# EAGLE design Teensy_Stromzaehler (EAGLE 9.6.0)
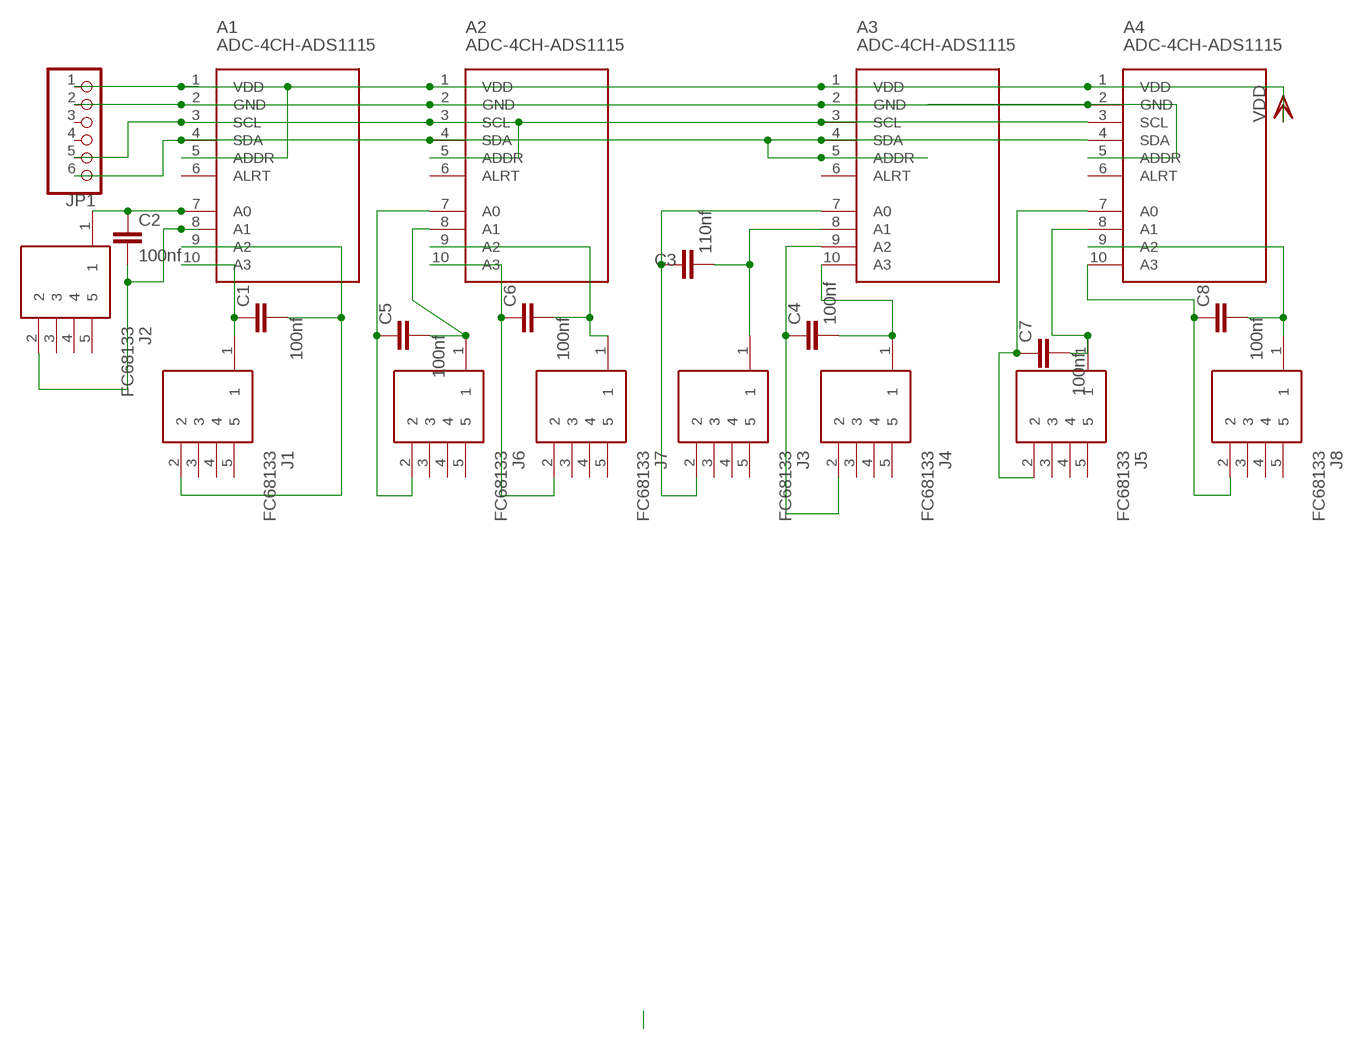
[diagram p0: schematic, sheet 1]

## Parts
A1  ADC-4CH-ADS1115  [ADC-4CH-ADS1115]
A2  ADC-4CH-ADS1115  [ADC-4CH-ADS1115]
A3  ADC-4CH-ADS1115  [ADC-4CH-ADS1115]
A4  ADC-4CH-ADS1115  [ADC-4CH-ADS1115]
C1  100nf  C-EU025-024X044  [C025-024X044]
C2  100nf  C-EU025-024X044  [C025-024X044]
C3  110nf  C-EU025-024X044  [C025-024X044]
C4  100nf  C-EU025-024X044  [C025-024X044]
C5  100nf  C-EU025-024X044  [C025-024X044]
C6  100nf  C-EU025-024X044  [C025-024X044]
C7  100nf  C-EU025-024X044  [C025-024X044]
C8  100nf  C-EU025-024X044  [C025-024X044]
J1  FC68133  [FC68133]
J2  FC68133  [FC68133]
J3  FC68133  [FC68133]
J4  FC68133  [FC68133]
J5  FC68133  [FC68133]
J6  FC68133  [FC68133]
J7  FC68133  [FC68133]
J8  FC68133  [FC68133]
JP1  PINHD-1X6  [1X06]

## Nets
N$1: A1.7(A0) C2.1 J2.1
N$2: A1.8(A1) C2.2 J2.2
N$3: A1.9(A2) C1.2 J1.2
N$4: A1.10(A3) C1.1 J1.1
N$5: A3.8(A1) C3.2 J3.1
N$6: A3.10(A3) C4.2 J4.1
N$7: A4.7(A0) C7.1 J5.2
N$8: A3.7(A0) C3.1 J3.2
N$9: A1.2(GND) A2.2(GND) A3.2(GND) A4.2(GND) A4.5(ADDR) JP1.2
N$10: A2.7(A0) C5.1 J6.2
N$11: A2.8(A1) C5.2 J6.1
N$12: A1.3(SCL) A2.3(SCL) A2.5(ADDR) A3.3(SCL) A4.3(SCL) JP1.5
N$13: A2.10(A3) C6.1 J7.2
N$14: A2.9(A2) C6.2 J7.1
N$15: A1.4(SDA) A2.4(SDA) A3.4(SDA) A3.5(ADDR) A4.4(SDA) JP1.6
N$17: A3.9(A2) C4.1 J4.2
N$18: A4.8(A1) C7.2 J5.1
N$19: A4.9(A2) C8.2 J8.1
N$20: A4.10(A3) C8.1 J8.2
VDD: A1.1(VDD) A1.5(ADDR) A2.1(VDD) A3.1(VDD) A4.1(VDD) JP1.1
Unconnected: A1.6(ALRT) A2.6(ALRT) A3.6(ALRT) A4.6(ALRT) J1.3 J1.4 J1.5 J2.3 J2.4 J2.5 J3.3 J3.4 J3.5 J4.3 J4.4 J4.5 J5.3 J5.4 J5.5 J6.3 J6.4 J6.5 J7.3 J7.4 J7.5 J8.3 J8.4 J8.5 JP1.3 JP1.4

## Library data of the parts
A1-A4 = diy-modules:ADC-4CH-ADS1115: 4 Channel 16-Bit Analog-to-Digital Converter based on ADS1115 chip Arduino ADS1115 Getting Started Tutorial is available here: http://henrysbench.capnfatz.com/henrys-bench/arduino-voltage-measurements/arduino-ads1115-module-getting-started-tutorial/ ADS1115 datasheet is available here: http://www.ti.com/lit/ds/symlink/ads1115.pdf Click here to find device on ebay.com <http://www.ebay.com/sch/ads1115+module>
C1-C8 = rcl:C-EU: CAPACITOR, European symbol; SPICEPREFIX: C
J1-J8 = FC68133:FC68133: CLIFF ELECTRONIC COMPONENTS - FC68133 - STEREO JACK, 3.5MM, 5POS, PCB Source: Datasheet <http://www.cliffuk.co.uk/products/jacksockets/js2535.htm>; DESCRIPTION: CLIFF ELECTRONIC COMPONENTS - FC68133 - STEREO JACK, 3.5MM, 5POS, PCB; HEIGHT: 5mm; MANUFACTURER_NAME: CLIFF ELECTRONIC COMPONENTS; MANUFACTURER_PART_NUMBER: FC68133
JP1 = pinhead:PINHD-1X6: PIN HEADER

## Board
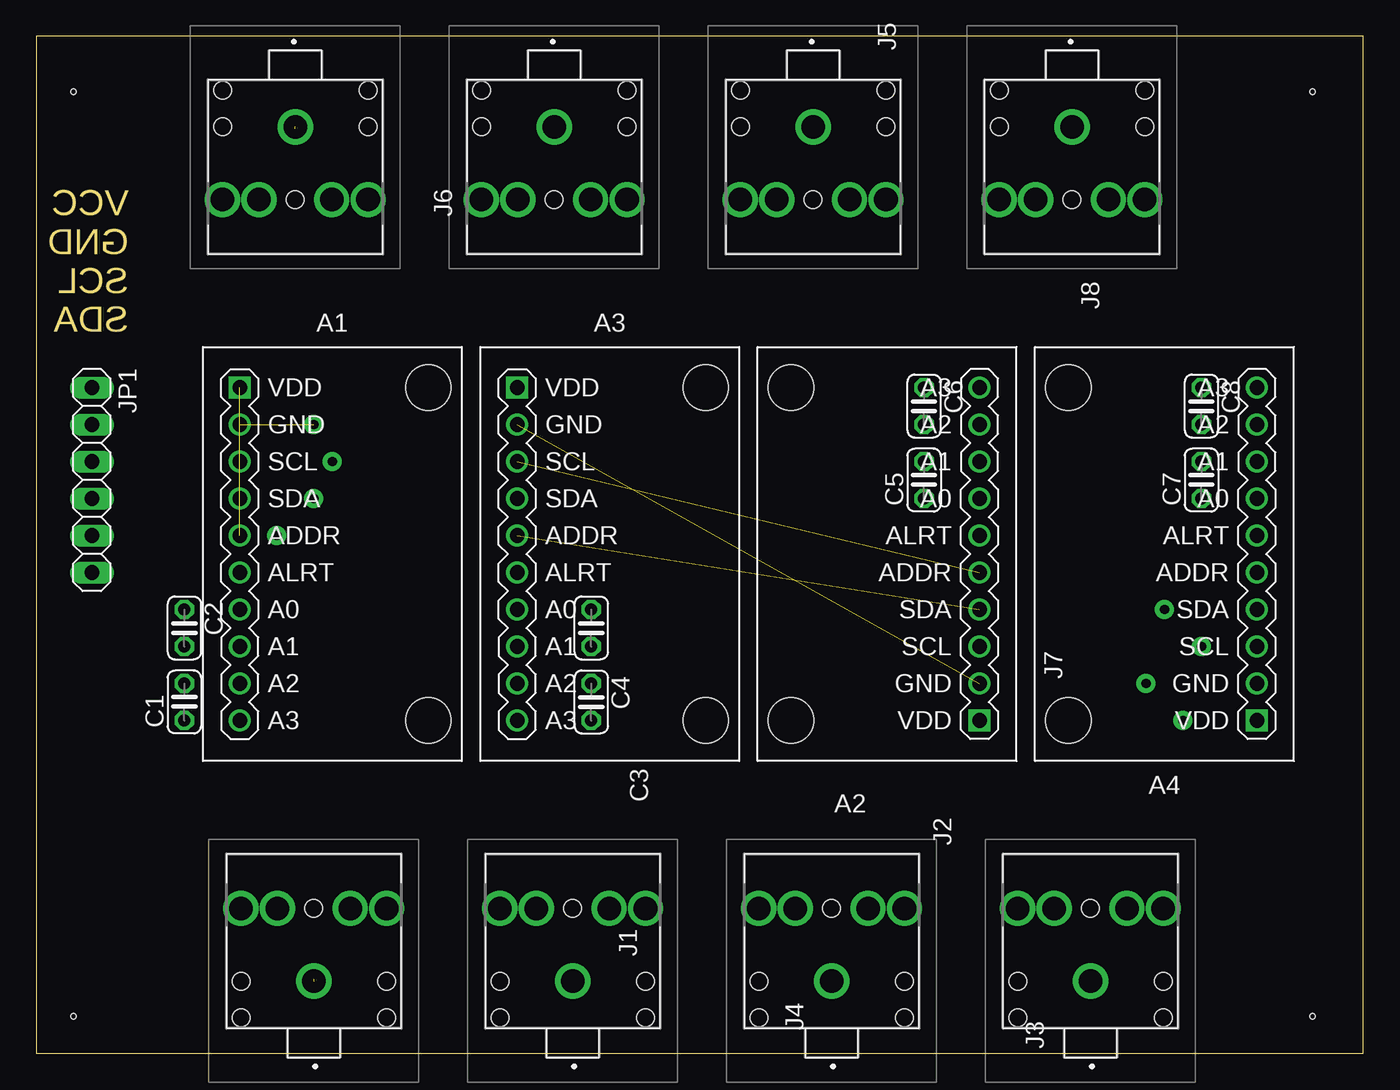
[diagram p1: board, top side]
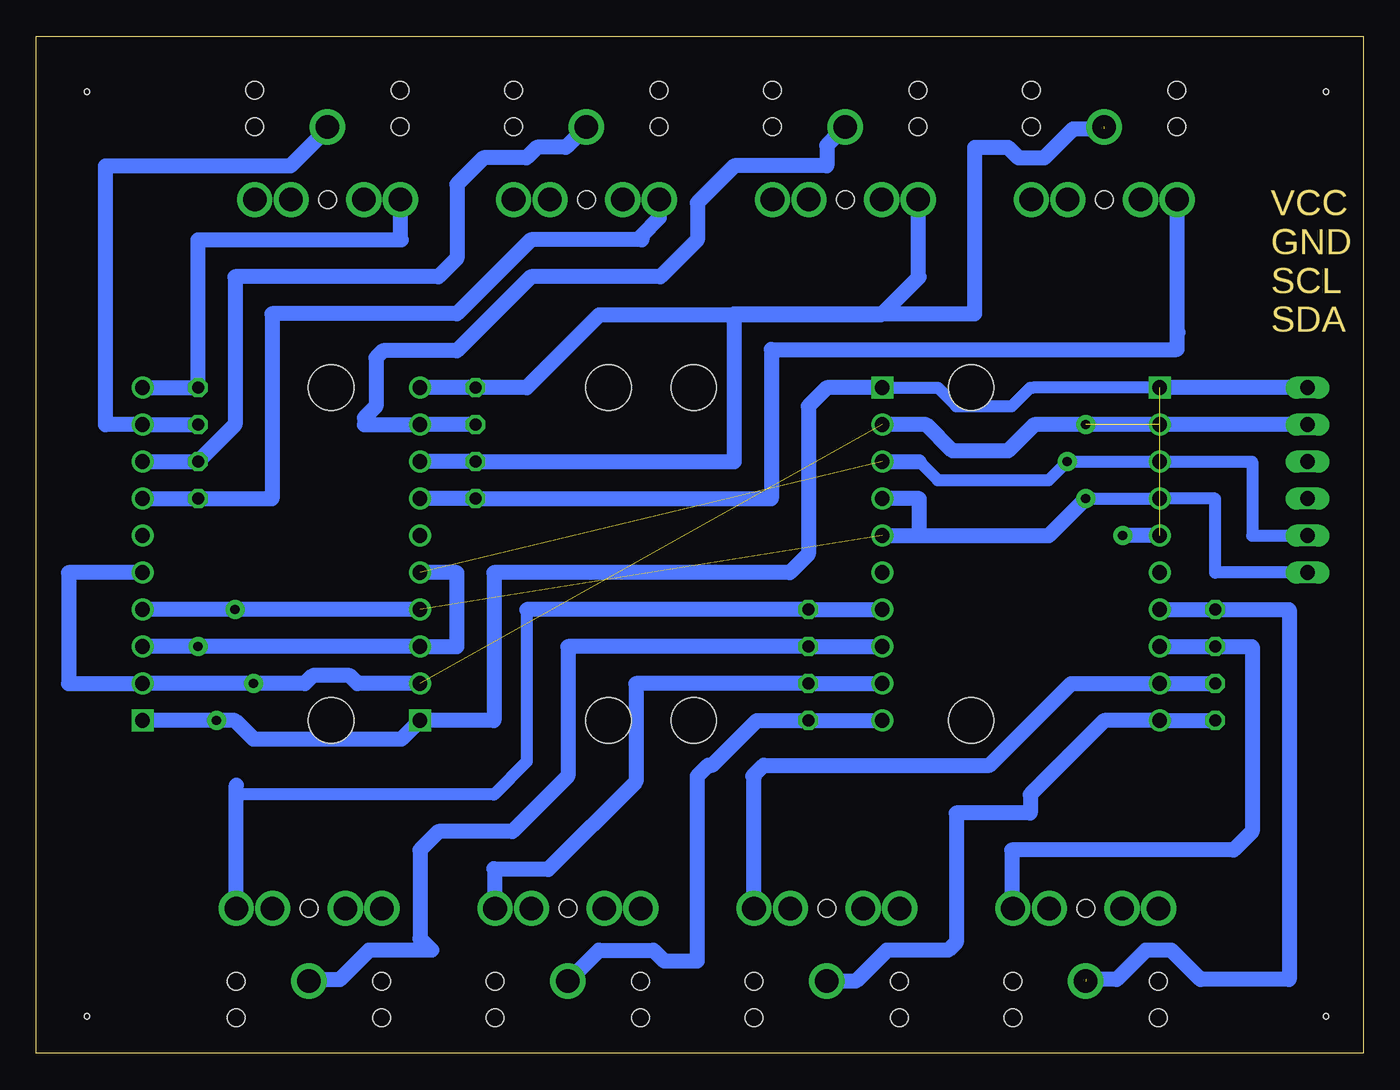
[diagram p2: board, bottom side, seen from below]

Size 91.11 x 69.84 mm. Coordinates in mm from the lower left corner, seen from the top.
Outline: 0,0 91.11,0 91.11,69.84 0,69.84 0,0
Copper layers (1*16): Top 0.035mm / dielectric 1.5mm / Bottom 0.035mm
Design rules "default": minimum track width 6mil, minimum drill 0.35mm, track to track 6mil, track to pad 6mil, pad to pad 6mil, via to via 6mil, smd to smd 6mil, copper to edge 40mil, drill to drill 6mil, minimum pad ring 10mil, minimum via ring 8mil, stop-mask expansion 4mil, vias tented up to drill 0mil, thermal gap 10mil
Holes 0.35 mm at 2.54,66.04 87.63,66.04 87.63,2.54 2.54,2.54

### Footprints (pad centres in the part's own frame; a part is rotated, then mirrored left to right if it is on the bottom)
ADC-4CH-ADS1115 = drill 1 square: 1 -6.35,11.43 | drill 1: 2 -6.35,8.89; 3 -6.35,6.35; 4 -6.35,3.81; 5 -6.35,1.27; 6 -6.35,-1.27; 7 -6.35,-3.81; 8 -6.35,-6.35; 9 -6.35,-8.89; 10 -6.35,-11.43 | hole 3.1: 6.604,11.43; 6.604,-11.43
C025-024X044 = drill 0.813 octagon: 1 -1.27,0; 2 1.27,0
FC68133 = drill 1.615 pad 2.423: 1 -1.4,0; 2 3.6,-5; 3 3.6,-2.5; 4 3.6,2.5; 5 3.6,5 | hole 1.2: 3.6,0; -1.4,-5; -3.9,-5; -3.9,5; -1.4,5
1X06 = drill 1.016 long: 1 -6.35,0; 2 -3.81,0; 3 -1.27,0; 4 1.27,0; 5 3.81,0; 6 6.35,0

### Placement (x,y rotation side)
A1  20.32,34.29 0 top
A2  58.42,34.29 180 top
A3  39.37,34.29 0 top
A4  77.47,34.29 180 top
C1  10.16,24.13 90 top
C2  10.16,29.21 270 top
C3  38.1,29.21 270 top
C4  38.1,24.13 270 top
C5  60.96,39.37 90 top
C6  60.96,44.45 270 top
C7  80.01,39.37 90 top
C8  80.01,44.45 270 top
J1  36.83,6.35 90 top
J2  19.05,6.35 90 top
J3  72.39,6.35 90 top
J4  54.61,6.35 90 top
J5  53.34,62.23 270 top
J6  17.78,62.23 270 top
J7  35.56,62.23 270 top
J8  71.12,62.23 270 top
JP1  3.81,39.37 270 top

### Tracks (layer width: path | path; a pad name or v marks a point on that pad's centre or on a via)
N$1  (1 unrouted)
  Bottom 1.016: A1.7 C2.1 5.08,30.48 5.08,5.08 11.18,5.08 13.17,7.07 14.93,7.07 16.92,5.08 19.05,5.08
N$2
  Bottom 1.016: A1.8 C2.2 7.62,27.94 7.62,15.24 8.89,13.97 24.13,13.97 24.13,10.03 J2.2
N$3
  Bottom 1.016: C1.2 A1.9 20.04,25.4 25.65,19.79 41.17,19.79 41.91,19.05 41.83,18.97 J1.2
N$4
  Bottom 1.016: C1.1 A1.10 17.78,22.86 22.86,17.78 22.86,16.51 27.94,16.51 27.94,7.62 28.49,7.07 32.71,7.07 34.83,4.95 J1.1
N$5
  Bottom 1.016: A3.8 C3.2 54.61,27.94 54.61,19.05 58.42,15.24 63.5,15.24 64.77,13.97 64.77,7.87 63.97,7.07 68.27,7.07 70.26,5.08 72.39,5.08 J3.1
N$6
  Bottom 1.016: A3.10 C4.2 41.63,22.86 44.7,19.79 44.98,19.79 45.72,19.05 45.72,6.35 48.01,6.35 48.73,7.07 52.49,7.07 J4.1
N$7
  Bottom 1.016: A4.7 C7.1 74.93,38.1 74.93,50.8 62.23,50.8 57.15,55.88 49.53,55.88 49.53,56.17 48.34,57.36 J5.2
N$8
  Bottom 0.813: 57.43,30.48 57.43,20.04 59.69,17.78 77.39,17.78
  Bottom 1.016: A3.7 C3.1 57.43,30.48 | J3.2 77.39,17.78 77.39,18.41
N$9  (via drill 0.65 pad 1.3)  (2 unrouted)
  Bottom 1.016: JP1.2 v19.05,43.18 22.58,43.18 24.38,41.38 28.2,41.38 30,43.18 A3.2 | A2.2 69.06,25.4 69.59,25.93 72.14,25.93 72.67,25.4 v76.2,25.4 A4.2 88.9,25.4 88.9,33.02 A4.5
N$10
  Bottom 1.016: A2.7 C5.1 40.64,38.1 40.64,48.34 12.78,48.34 12.78,49.61 | J6.2 12.78,49.61 | 12.78,49.61 12.7,49.53
N$11  (1 unrouted)
  Bottom 1.016: A2.8 C5.2 43.18,40.64 43.18,50.8 26.67,50.8 26.67,62.23 24.38,62.23 23.66,61.51 21.9,61.51 19.91,63.5 17.78,63.5
N$12  (via drill 0.65 pad 1.3)  (1 unrouted)
  Bottom 0.813: JP1.5 7.62,35.56 7.62,40.64 A1.3 v20.32,40.64 21.59,39.37 29.21,39.37 30.48,40.64
  Bottom 1.016: A3.3 30.48,40.64 | A4.3 v80.01,27.94 A2.3 62.23,27.94 62.23,33.02 A2.5
N$13
  Bottom 1.016: A2.10 C6.1 57.43,45.72 52.45,50.7 33.12,50.7 30.48,53.34 30.56,53.42 J7.2
N$14
  Bottom 1.016: C6.2 A2.9 68.58,43.18 68.58,43.66 67.79,44.45 67.79,47.78 67.31,48.26 62.23,48.26 57.15,53.34 48.26,53.34 45.72,55.88 45.72,58.42 43.18,60.96 36.83,60.96 36.83,62.36 J7.1
N$15  (via drill 0.65 pad 1.3)  (1 unrouted)
  Bottom 0.813: JP1.6 10.16,33.02 10.16,38.1 A1.4 v19.05,38.1
  Bottom 1.016: v19.05,38.1 21.59,35.56 30.48,35.56 | A3.4 30.48,38.1 30.48,35.56 | A3.5 30.48,35.56 | A2.4 v77.47,30.48 A4.4
N$17
  Bottom 1.016: A3.9 C4.1 49.93,25.4 49.93,18.65 55.96,12.62 59.61,12.62 | J4.2 59.61,12.62 | 59.61,12.62 59.69,12.7
N$18
  Bottom 1.016: A4.8 C7.2 77.47,43.18 77.47,53.34 63.5,53.34 62.23,54.61 62.23,59.69 60.41,61.51 57.46,61.51 56.74,62.23 54.74,62.23 J5.1
N$19
  Bottom 1.016: C8.2 A4.9 86.36,43.18 86.36,60.96 73.66,60.96 71.12,63.5 J8.1
N$20
  Bottom 1.016: A4.10 C8.1 80.01,55.88 66.04,55.88 66.12,55.96 J8.2
VDD  (via drill 0.65 pad 1.3)  (1 unrouted)
  Bottom 0.813: A1.1 22.68,45.72 22.86,45.72 24.13,44.45 27.94,44.45 29.21,45.72 A3.1
  Bottom 1.016: JP1.1 A1.1 | A1.5 v16.51,35.56 | A4.1 v78.74,22.86 77.47,22.86 76.2,21.59 66.04,21.59 A2.1 59.69,22.86 59.69,33.02 39.37,33.02 38.1,34.29 38.1,44.45 36.83,45.72 A3.1

### Text on the board
Milling: VCC / GND / SCL / SDA